# EAGLE schematic M20050-1 GPS Breakout Board 2 (EAGLE 9.6.2)
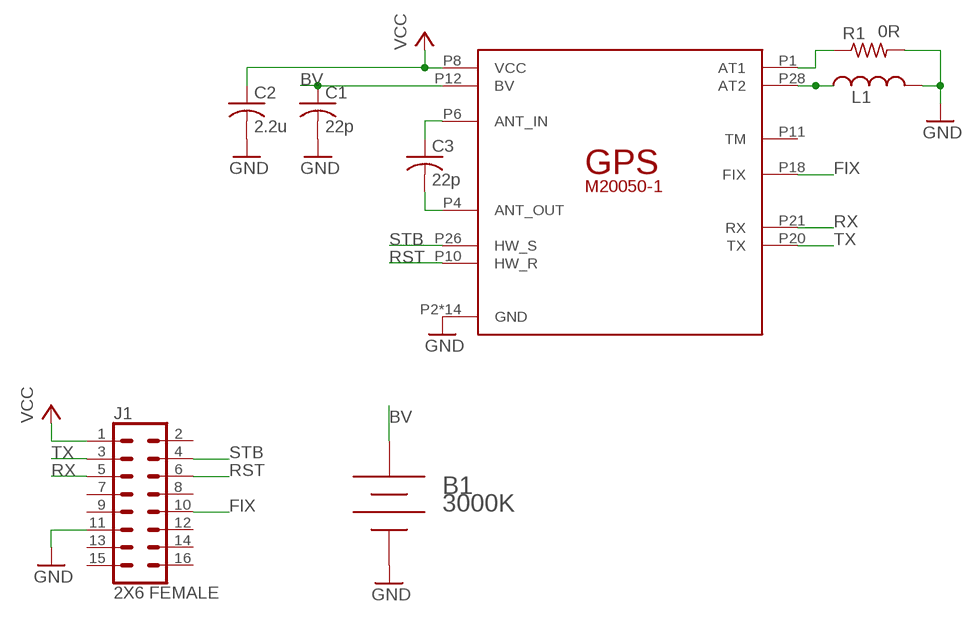
[diagram p0: schematic, sheet 1]

## Parts
A1  GPS_M20050-1  [M20050-1_GPS]
B1  3000K  [3000K]
C1  22p  C-ALL_PACKAGESC1206  [C1206]
C2  2.2u  C-ALL_PACKAGESC1206  [C1206]
C3  22p  C-ALL_PACKAGESC1206  [C1206]
J1  2X6 FEMALE  SENSOR_BREAKOUTPTH_FEMALE  [2X7]
L1  1.8n  AIMC-0805-1N8S-T  [INDC2012X105N]
R1  0R  R-ALL_PACKAGESR1206  [R1206]

## Nets
BV: A1.P12(BV) B1.+ C1.1
FIX: A1.P18(FIX) J1.10
GND: A1.P2(GND) A1.P3(GND) A1.P5(GND) A1.P7(GND) A1.P9(GND) A1.P15(GND) A1.P16(GND) A1.P17(GND) A1.P19(GND) A1.P22(GND) A1.P23(GND) A1.P24(GND) A1.P25(GND) A1.P27(GND) B1.- C1.2 C2.2 J1.11 L1.2 R1.2
N$1: A1.P6(ANT_IN) C3.1
N$2: A1.P4(ANT_OUT) C3.2
N$3: A1.P1(AT1) R1.1
N$4: A1.P28(AT2) L1.1
RST: A1.P10(HW_R) J1.6
RX: A1.P21(RX) J1.5
STB: A1.P26(HW_S) J1.4
TX: A1.P20(TX) J1.3
VCC: A1.P8(VCC) C2.1 J1.1
Unconnected: A1.P11(TM) J1.2 J1.7 J1.8 J1.9 J1.12 J1.13 J1.14 J1.15 J1.16

## Library data of the parts
A1 = M20050-1 GPS:GPS_M20050-1
B1 = b_keystone_3000k_sm_battery:3000K: SMT Battery Holder from Keystone for 12mm coin cells BR1216, CR1216, BR1220, CL1220, CR1220, BR1225
C1-C3 = RTR Main Library:C-ALL_PACKAGES: CAPACITOR, American symbol
J1 = RTR Main Library:SENSOR_BREAKOUT: .1 inch-spaced 12P sensor breakout Used as a generalized connector for attaching new sensors; PROD_ID: CONN-12423
L1 = AIMC-0805-1N8S-T:AIMC-0805-1N8S-T: 1.8nH Unshielded Multilayer Inductor 600mA 100mOhm Max 0805 (2012 Metric); DESCRIPTION: IND 1.8nH 0.3A 100mΩ; DIGI-KEY_PART_NUMBER: 535-11559-1-ND; MF: Abracon; MP: AIMC-0805-1N8S-T; PACKAGE: 2012 Bourns; PURCHASE-URL: https://pricing.snapeda.com/search/part/AIMC-0805-1N8S-T/?ref=eda
R1 = RTR Main Library:R-ALL_PACKAGES: RESISTOR, American symbol